# EasyEDA schematic s3_dev.json
TITLE: Sheet_1; REV: 1.0; Date: 2022-10-13; Sheet: 1/1; Drawn By: marchingband; Company: Your Company
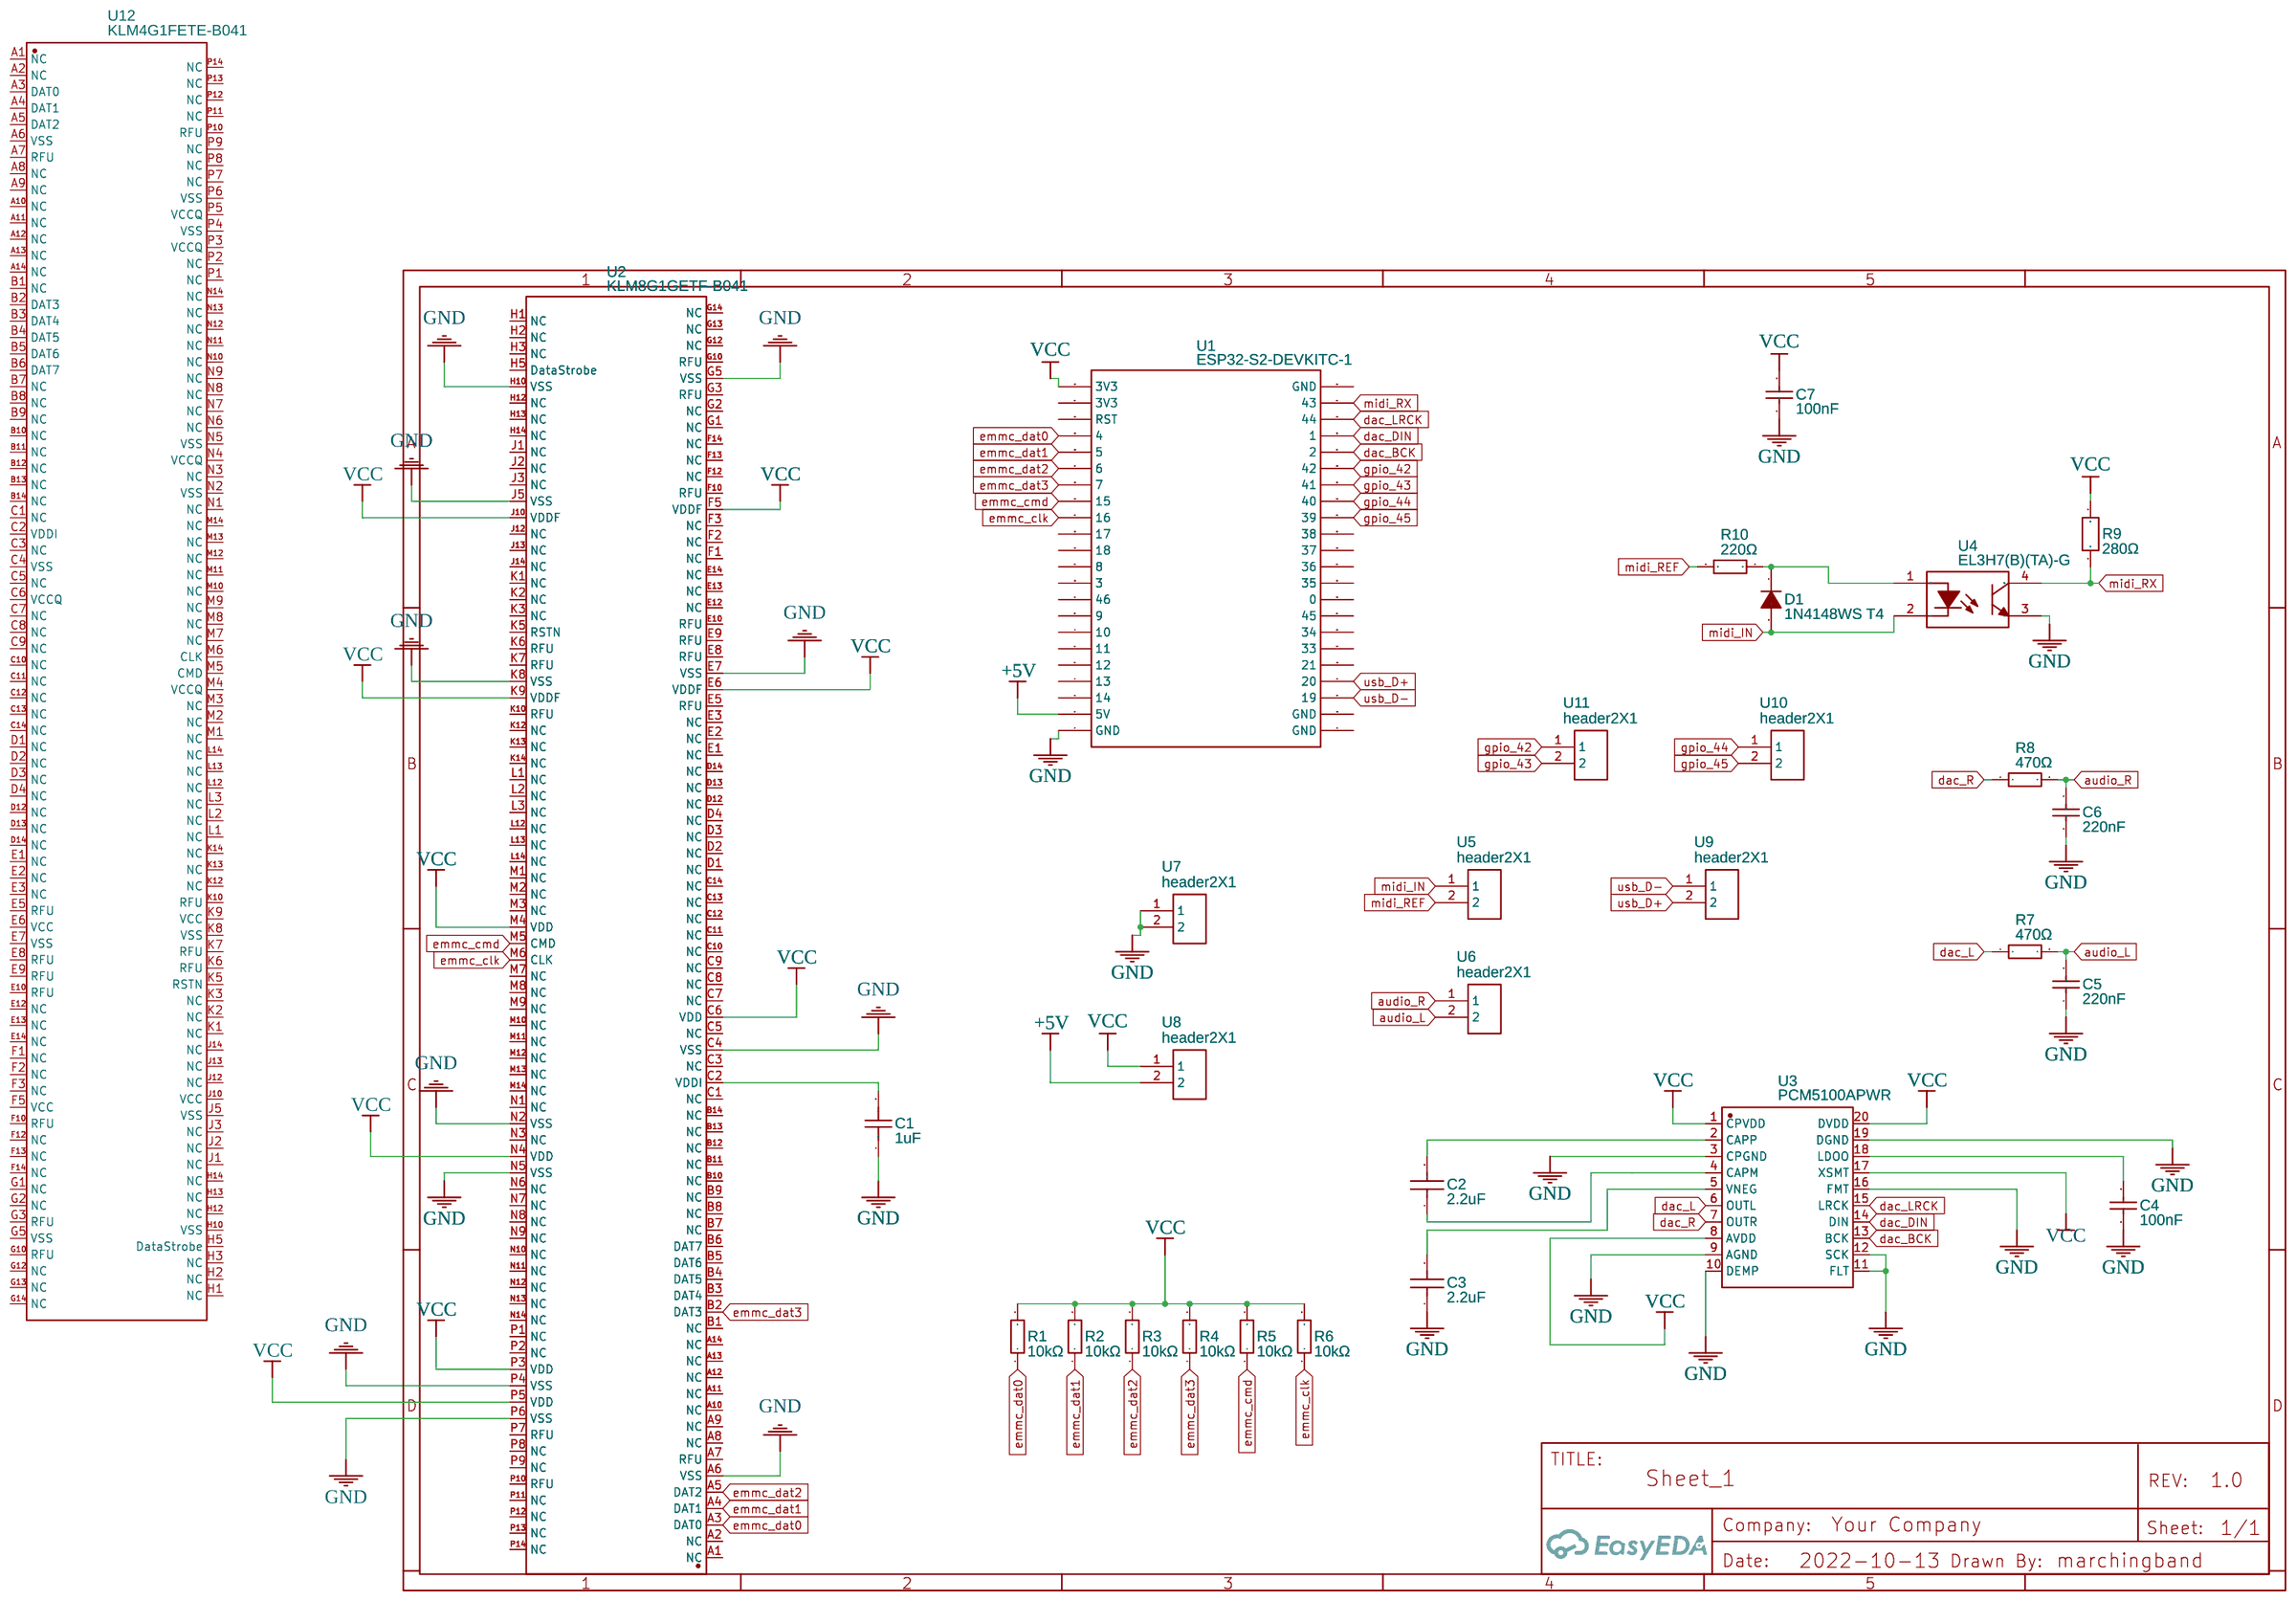
[diagram p0: schematic sheet]

## Parts
C1  1uF  [C0402]
C2  2.2uF  [C0402]
C3  2.2uF  [C0402]
C4  100nF  [C0402_NEW]
C5  220nF  [C0402]
C6  220nF  [C0402]
C7  100nF  [C0402_NEW]
D1  1N4148WS T4  [SOD-323_L1.8-W1.3-LS2.5-RD]
R1  10kΩ  [R0402]
R2  10kΩ  [R0402]
R3  10kΩ  [R0402]
R4  10kΩ  [R0402]
R5  10kΩ  [R0402]
R6  10kΩ  [R0402]
R7  470Ω  [R0402]
R8  470Ω  [R0402]
R9  280Ω  [R0402]
R10  220Ω  [R0402]
U1  ESP32-S2-DEVKITC-1  [ESP32-S3-DEVKITC-1]
U2  KLM8G1GETF-B041  [FBGA-153_L13.0-W11.5-P0.50_KLMAG1JETD-B041]
U3  PCM5100APWR  [TSSOP-20_L6.5-W4.4-P0.65-LS6.4-BL]
U4  EL3H7(B)(TA)-G  [SOP-4_L4.4-W2.8-P1.27-LS7.0-TL]
U5  header2X1  [HEADER2X1]
U6  header2X1  [HEADER2X1]
U7  header2X1  [HEADER2X1]
U8  header2X1  [HEADER2X1]
U9  header2X1  [HEADER2X1]
U10  header2X1  [HEADER2X1]
U11  header2X1  [HEADER2X1]
U12  KLM4G1FETE-B041  [FBGA-153_L11.0-W10.0-P0.50_KLM4G1FETE-B041]

## Library data of the parts
C1 = CL05A105KA5NQNC: Supplier: LCSC; Manufacturer: SAMSUNG; Supplier Part: C52923; JLCPCB Part Class: Basic Part
C2 C3 = CL05A225MQ5NSNC: Supplier: LCSC; Manufacturer: SAMSUNG; Supplier Part: C12530; JLCPCB Part Class: Basic Part
C4 C7 = CL05B104KO5NNNC: Supplier: LCSC; Manufacturer: SAMSUNG; Supplier Part: C1525; JLCPCB Part Class: Basic Part
C5 C6 = CL05B224KO5NNNC: Supplier: LCSC; Manufacturer: SAMSUNG; Supplier Part: C16772; JLCPCB Part Class: Basic Part
D1 = 1N4148WS T4: Supplier: LCSC; Manufacturer: CJ; Supplier Part: C2128; JLCPCB Part Class: Basic Part
R1-R6 = 0402WGF1002TCE: Supplier: LCSC; Manufacturer: UniOhm; Supplier Part: C25744; Resistance (Ohms): 10K; JLCPCB Part Class: Basic Part
R7 R8 = 0402WGF4700TCE: Supplier: LCSC; Manufacturer: UniOhm; Supplier Part: C25117; Resistance (Ohms): 470; JLCPCB Part Class: Basic Part
R9 = 0402WGF2800TCE: Supplier: LCSC; Supplier Part: C423200; Manufacturer: Uniroyal Elec; Resistance (Ohms): 280; Contributor: LCSC; JLCPCB Part Class: Extended Part
R10 = 0402WGF2200TCE: Supplier: LCSC; Manufacturer: UniOhm; Supplier Part: C25091; Resistance (Ohms): 220; JLCPCB Part Class: Basic Part
U1 = ESP32-S2-DEVKITC-1: Manufacturer: Espressif; Supplier: Espressif; Supplier Part: ESP32-S3-DevKitC-1; Contributor: Querrin
U2 = KLM8G1GETF-B041: Supplier: LCSC; Supplier Part: C499918; Manufacturer: Samsung; Contributor: LCSC; JLCPCB Part Class: Extended Part
U3 = PCM5100APWR: Supplier: LCSC; Manufacturer: TI; Contributor: LCSC; Supplier Part: C131154; JLCPCB Part Class: Extended Part
U4 = EL3H7(B)(TA)-G: Supplier: LCSC; Manufacturer: EVERLIGHT; Supplier Part: C32565; JLCPCB Part Class: Basic Part
U5-U11 = header2X1: Contributor: 이기우
U12 = KLM4G1FETE-B041: Supplier: LCSC; Supplier Part: C500273; Manufacturer: Samsung; Contributor: LCSC

## Nets
+5V: U1.2(5V) U8.2
GND: C1.1 C3.1 C4.1 C5.1 C6.1 C7.1 U1.1(GND) U2.A6(VSS) U2.C4(VSS) U2.E7(VSS) U2.G5(VSS) U2.H10(VSS) U2.J5(VSS) U2.K8(VSS) U2.N2(VSS) U2.N5(VSS) U2.P4(VSS) U2.P6(VSS) U3.3(CPGND) U3.9(AGND) U3.10(DEMP) U3.11(FLT) U3.12(SCK) U3.16(FMT) U3.19(DGND) U4.3(EM) U7.1 U7.2
VCC: C7.2 R1.2 R2.2 R3.2 R4.2 R5.2 R6.2 R9.2 U1.22(3V3) U2.C6(VDD) U2.E6(VDDF) U2.F5(VDDF) U2.J10(VDDF) U2.K9(VDDF) U2.M4(VDD) U2.N4(VDD) U2.P3(VDD) U2.P5(VDD) U3.1(CPVDD) U3.8(AVDD) U3.17(XSMT) U3.20(DVDD) U8.1
audio_L: C5.2 R7.2 U6.2
audio_R: C6.2 R8.2 U6.1
dac_BCK: U1.27(2) U3.13(BCK)
dac_DIN: U1.26(1) U3.14(DIN)
dac_L: R7.1 U3.6(OUTL)
dac_LRCK: U1.25(44) U3.15(LRCK)
dac_R: R8.1 U3.7(OUTR)
emmc_clk: R6.1 U1.14(16) U2.M6(CLK)
emmc_cmd: R5.1 U1.15 U2.M5(CMD)
emmc_dat0: R1.1 U1.19(4) U2.A3(DAT0)
emmc_dat1: R2.1 U1.18(5) U2.A4(DAT1)
emmc_dat2: R3.1 U1.17(6) U2.A5(DAT2)
emmc_dat3: R4.1 U1.16(7) U2.B2(DAT3)
gpio_42: U1.28(42) U11.1
gpio_43: U1.29(41) U11.2
gpio_44: U1.30(40) U10.1
gpio_45: U1.31(39) U10.2
midi_IN: D1.2(A) U4.2(CAT) U5.1
midi_REF: R10.1 U5.2
midi_RX: R9.1 U1.24(43) U4.4(COL)
usb_D+: U1.41(20) U9.2
usb_D-: U1.42(19) U9.1
Net-(C1-2): C1.2 U2.C2(VDDI)
Net-(C2-1): C2.1 U3.4(CAPM)
Net-(C2-2): C2.2 U3.2(CAPP)
Net-(C3-2): C3.2 U3.5(VNEG)
Net-(C4-2): C4.2 U3.18(LDOO)
Net-(D1-1): D1.1(K) R10.2 U4.1(AN)

Not connected (* = marked no-connect by the designer): U1 3(14) 4(13) 5(12) 6(11) 7(10) 8(9) 9(46) 10(3) 11(8) 12(18) 13(17) 20(RST) 21(3V3) 23(GND) 32(38) 33(37) 34(36) 35 36(0) 37(45) 38(34) 39(33) 40(21) 43(GND) 44(GND); U2 A1(NC) A2(NC) A7(RFU) A8(NC) A9(NC) A10(NC) A11(NC) A12(NC) A13(NC) A14(NC) B1(NC) B3(DAT4) B4(DAT5) B5(DAT6) B6(DAT7) B7(NC) B8(NC) B9(NC) B10(NC) B11(NC) B12(NC) B13(NC) B14(NC) C1(NC) C3(NC) C5(NC) C7(NC) C8(NC) C9(NC) C10(NC) C11(NC) C12(NC) C13(NC) C14(NC) D1(NC) D2(NC) D3(NC) D4(NC) D12(NC) D13(NC) D14(NC) E1(NC) E2(NC) E3(NC) E5(RFU) E8(RFU) E9(RFU) E10(RFU) E12(NC) E13(NC) E14(NC) F1(NC) F2(NC) F3(NC) F10(RFU) F12(NC) F13(NC) F14(NC) G1(NC) G2(NC) G3(RFU) G10(RFU) G12(NC) G13(NC) G14(NC) H1(NC) H2(NC) H3(NC) H5(DataStrobe) H12(NC) H13(NC) H14(NC) J1(NC) J2(NC) J3(NC) J12(NC) J13(NC) J14(NC) K1(NC) K2(NC) K3(NC) K5(RSTN) K6(RFU) K7(RFU) K10(RFU) K12(NC) K13(NC) K14(NC) L1(NC) L2(NC) L3(NC) L12(NC) L13(NC) L14(NC) M1(NC) M2(NC) M3(NC) M7(NC) M8(NC) M9(NC) M10(NC) M11(NC) M12(NC) M13(NC) M14(NC) N1(NC) N3(NC) N6(NC) N7(NC) N8(NC) N9(NC) N10(NC) N11(NC) N12(NC) N13(NC) N14(NC) P1(NC) P2(NC) P7(RFU) P8(NC) P9(NC) P10(RFU) P11(NC) P12(NC) P13(NC) P14(NC); U12 A1(NC) A2(NC) A3(DAT0) A4(DAT1) A5(DAT2) A6(VSS) A7(RFU) A8(NC) A9(NC) A10(NC) A11(NC) A12(NC) A13(NC) A14(NC) B1(NC) B2(DAT3) B3(DAT4) B4(DAT5) B5(DAT6) B6(DAT7) B7(NC) B8(NC) B9(NC) B10(NC) B11(NC) B12(NC) B13(NC) B14(NC) C1(NC) C2(VDDI) C3(NC) C4(VSS) C5(NC) C6(VCCQ) C7(NC) C8(NC) C9(NC) C10(NC) C11(NC) C12(NC) C13(NC) C14(NC) D1(NC) D2(NC) D3(NC) D4(NC) D12(NC) D13(NC) D14(NC) E1(NC) E2(NC) E3(NC) E5(RFU) E6(VCC) E7(VSS) E8(RFU) E9(RFU) E10(RFU) E12(NC) E13(NC) E14(NC) F1(NC) F2(NC) F3(NC) F5(VCC) F10(RFU) F12(NC) F13(NC) F14(NC) G1(NC) G2(NC) G3(RFU) G5(VSS) G10(RFU) G12(NC) G13(NC) G14(NC) H1(NC) H2(NC) H3(NC) H5(DataStrobe) H10(VSS) H12(NC) H13(NC) H14(NC) J1(NC) J2(NC) J3(NC) J5(VSS) J10(VCC) J12(NC) J13(NC) J14(NC) K1(NC) K2(NC) K3(NC) K5(RSTN) K6(RFU) K7(RFU) K8(VSS) K9(VCC) K10(RFU) K12(NC) K13(NC) K14(NC) L1(NC) L2(NC) L3(NC) L12(NC) L13(NC) L14(NC) M1(NC) M2(NC) M3(NC) M4(VCCQ) M5(CMD) M6(CLK) M7(NC) M8(NC) M9(NC) M10(NC) M11(NC) M12(NC) M13(NC) M14(NC) N1(NC) N2(VSS) N3(NC) N4(VCCQ) N5(VSS) N6(NC) N7(NC) N8(NC) N9(NC) N10(NC) N11(NC) N12(NC) N13(NC) N14(NC) P1(NC) P2(NC) P3(VCCQ) P4(VSS) P5(VCCQ) P6(VSS) P7(NC) P8(NC) P9(NC) P10(RFU) P11(NC) P12(NC) P13(NC) P14(NC)
